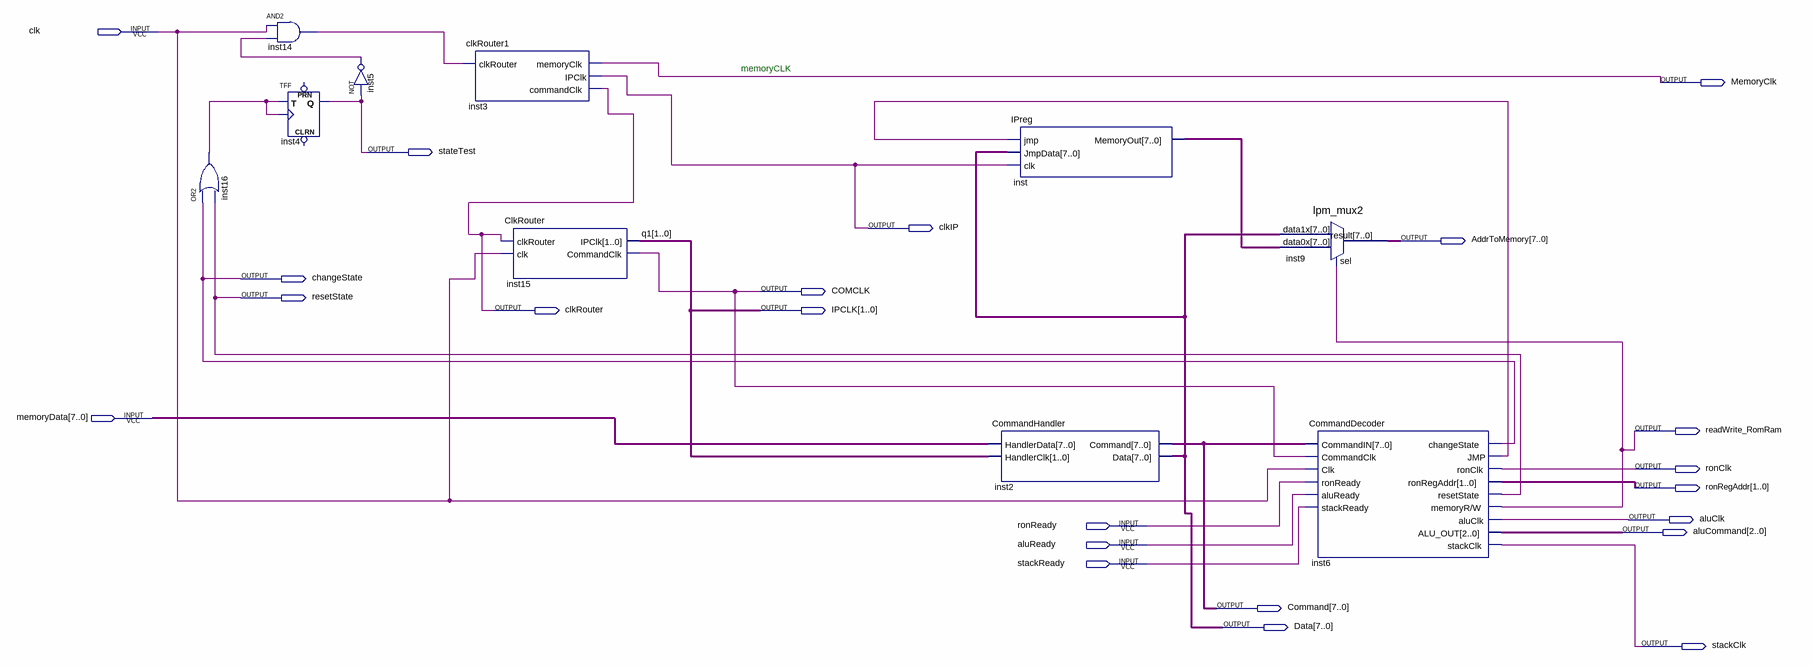
[diagram p0: schematic sheet]
// Quartus schematic control.bdf as structural Verilog: 10 symbols, 22 pins
module control (
  input  clk,
  input  [7:0] memoryData,
  input  ronReady,
  input  aluReady,
  input  stackReady,
  output MemoryClk,
  output stateTest,
  output clkIP,
  output [7:0] AddrToMemory,
  output changeState,
  output COMCLK,
  output resetState,
  output clkRouter,
  output [1:0] IPCLK,
  output readWrite_RomRam,
  output ronClk,
  output [1:0] ronRegAddr,
  output aluClk,
  output [2:0] aluCommand,
  output [7:0] Command,
  output [7:0] Data,
  output stackClk
);

  wire inst5_out, inst6_jmp, inst14_out, inst16_out;
  wire [7:0] inst_memoryout;

  or inst16 (inst16_out, changeState, resetState);
  and inst14 (inst14_out, clk, inst5_out);
  TFF inst4 (.T(inst16_out), .CLK(inst16_out), .Q(stateTest));  // open: PRN, CLRN
  not inst5 (inst5_out, stateTest);
  clkRouter1 inst3 (.clkRouter(inst14_out), .memoryClk(MemoryClk), .IPClk(clkIP), .commandClk(clkRouter));
  ClkRouter inst15 (.clkRouter(clkRouter), .clk(clk), .IPClk(IPCLK), .CommandClk(COMCLK));
  CommandHandler inst2 (.HandlerData(memoryData), .HandlerClk(IPCLK), .Command(Command), .Data(Data));
  IPreg inst (.jmp(inst6_jmp), .JmpData(Data), .clk(clkIP), .MemoryOut(inst_memoryout));
  lpm_mux2 inst9 (.data1x(Data), .data0x(inst_memoryout), .sel(readWrite_RomRam), .result(AddrToMemory));
  CommandDecoder inst6 (
    .CommandIN(Command), .CommandClk(COMCLK), .Clk(clk), .ronReady(ronReady), .aluReady(aluReady),
    .stackReady(stackReady), .changeState(changeState), .JMP(inst6_jmp), .ronClk(ronClk),
    .ronRegAddr(ronRegAddr), .resetState(resetState), .\memoryR/W (readWrite_RomRam), .aluClk(aluClk),
    .ALU_OUT(aluCommand), .stackClk(stackClk));

  // Other names for the same wires on the sheet: q1[1:0] = IPCLK

  // Notes on the sheet:
  //   memoryCLK
endmodule
